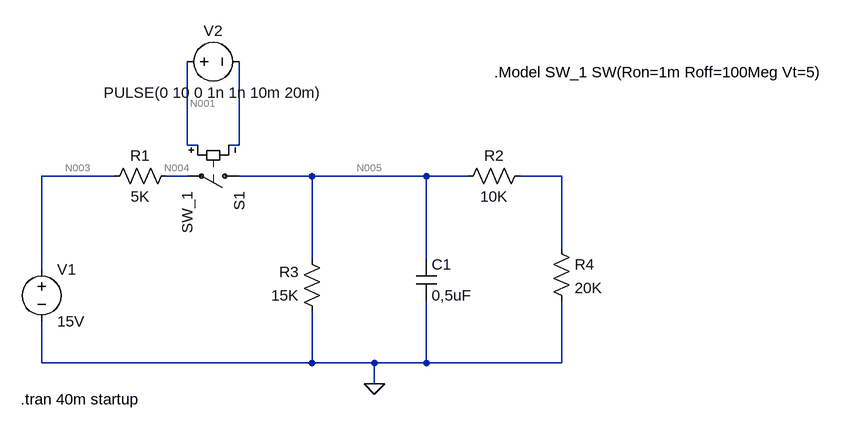
[diagram p0: schematic Draft2.asc]
Draft2.asc, the LTspice schematic file:
Version 4
SHEET 1 1216 680
WIRE 192 -48 192 -176
WIRE 208 -48 192 -48
WIRE 272 -48 272 -176
WIRE 272 -48 256 -48
WIRE 80 0 -32 0
WIRE 192 0 160 0
WIRE 384 0 272 0
WIRE 560 0 384 0
WIRE 624 0 560 0
WIRE 768 0 704 0
WIRE 768 112 768 0
WIRE 384 128 384 0
WIRE 560 128 560 0
WIRE -32 144 -32 0
WIRE -32 288 -32 224
WIRE 384 288 384 208
WIRE 384 288 -32 288
WIRE 480 288 384 288
WIRE 560 288 560 192
WIRE 560 288 480 288
WIRE 768 288 768 192
WIRE 768 288 560 288
WIRE 480 320 480 288
FLAG 480 320 0
SYMBOL cap 544 128 R0
SYMATTR InstName C1
SYMATTR Value 0,5uF
SYMBOL res 176 -16 R90
WINDOW 0 0 56 VBottom 2
WINDOW 3 32 56 VTop 2
SYMATTR InstName R1
SYMATTR Value 5K
SYMBOL res 720 -16 R90
WINDOW 0 0 56 VBottom 2
WINDOW 3 32 56 VTop 2
SYMATTR InstName R2
SYMATTR Value 10K
SYMBOL res 400 224 R180
WINDOW 0 36 76 Left 2
WINDOW 3 36 40 Left 2
SYMATTR InstName R3
SYMATTR Value 15K
SYMBOL res 752 96 R0
SYMATTR InstName R4
SYMATTR Value 20K
SYMBOL voltage -32 128 R0
SYMATTR InstName V1
SYMATTR Value 15V
SYMBOL sw 288 0 R90
SYMATTR InstName S1
SYMATTR Value SW_1
SYMBOL voltage 176 -176 R270
WINDOW 0 32 56 VTop 2
WINDOW 3 -32 56 VBottom 2
WINDOW 123 0 0 Left 0
WINDOW 39 0 0 Left 0
SYMATTR InstName V2
SYMATTR Value PULSE(0 10 0 1n 1n 10m 20m)
TEXT -64 344 Left 2 !.tran 40m startup
TEXT 664 -160 Left 2 !.Model SW_1 SW(Ron=1m Roff=100Meg Vt=5)

The netlist it stands for:
* Draft2.asc
C1 N005 0 0,5uF
R1 N004 N003 5K
R2 N006 N005 10K
R3 0 N005 15K
R4 N006 0 20K
V1 N003 0 15V
S1 N005 N004 N001 N002 SW_1
V2 N001 N002 PULSE(0 10 0 1n 1n 10m 20m)
.tran 40m startup
.Model SW_1 SW(Ron=1m Roff=100Meg Vt=5)
.backanno
.end

* Results of the author's LTspice run, read from the files saved beside the schematic
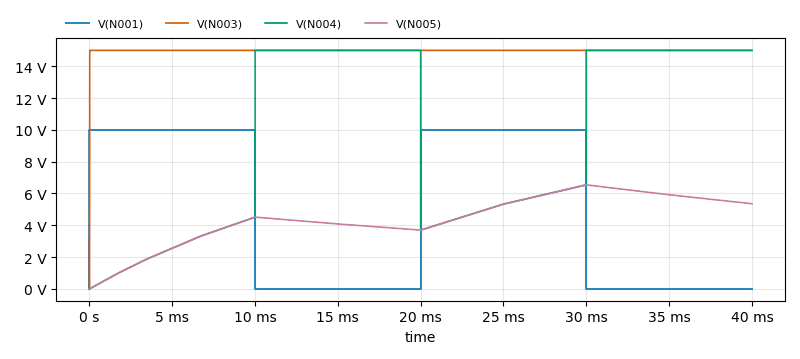
[diagram p1: Transient Analysis of Draft2.asc, plotted from the saved traces]
* Transient Analysis, 1 run:
*   V(N001): min 0 V, max 10 V, average 5 V, rms 7.071 V, last 0 V
*   V(N003): min 0 V, max 15 V, average 15 V, rms 15 V, last 15 V
*   V(N004): min 0 V, max 15 V, average 9.42 V, rms 11.03 V, last 15 V
*   V(N005): min 0 V, max 6.538 V, average 4.425 V, rms 4.701 V, last 5.353 V